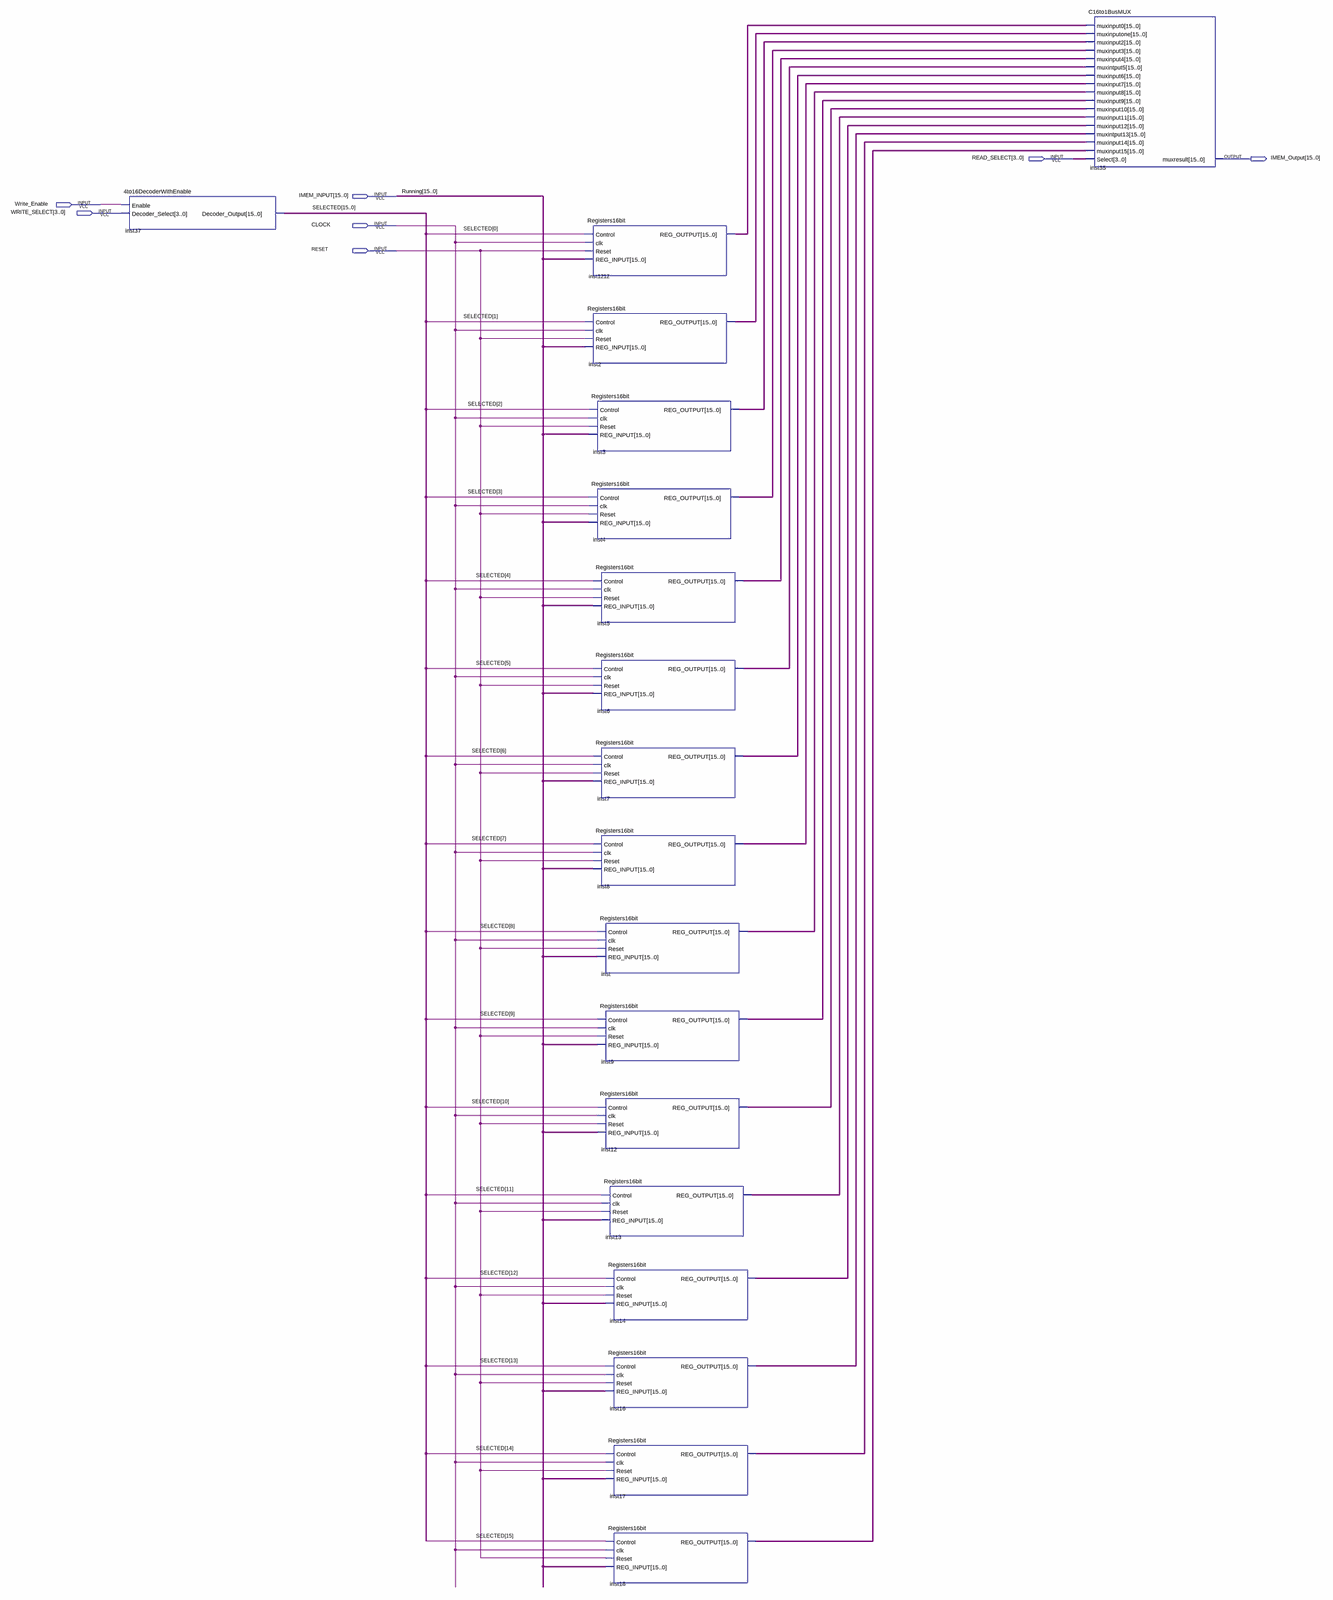
[diagram p0: schematic sheet, whole]
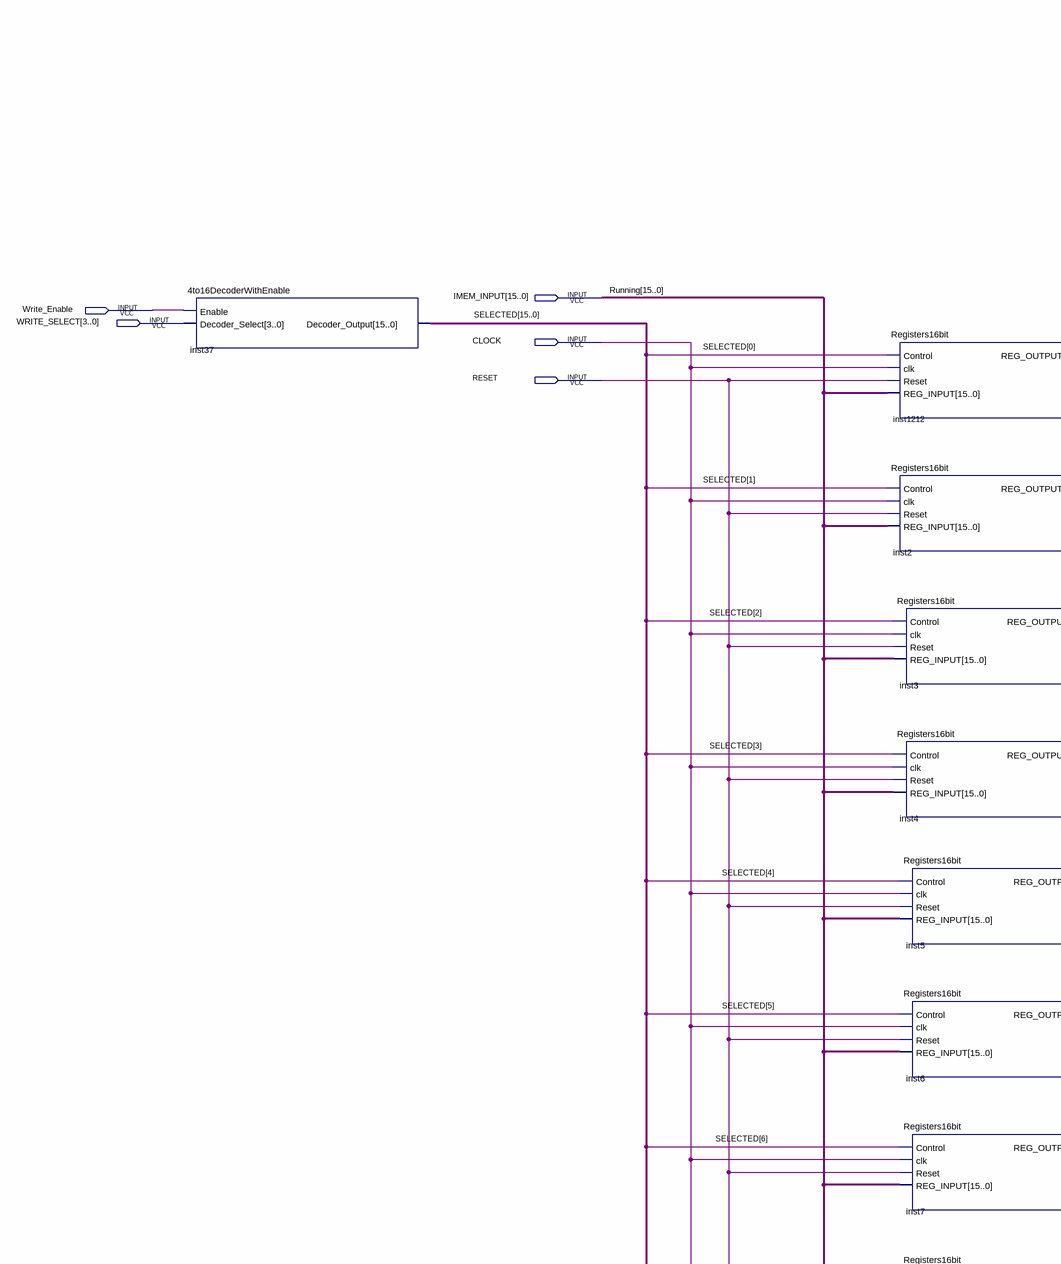
[diagram p1: schematic sheet, upper left part]
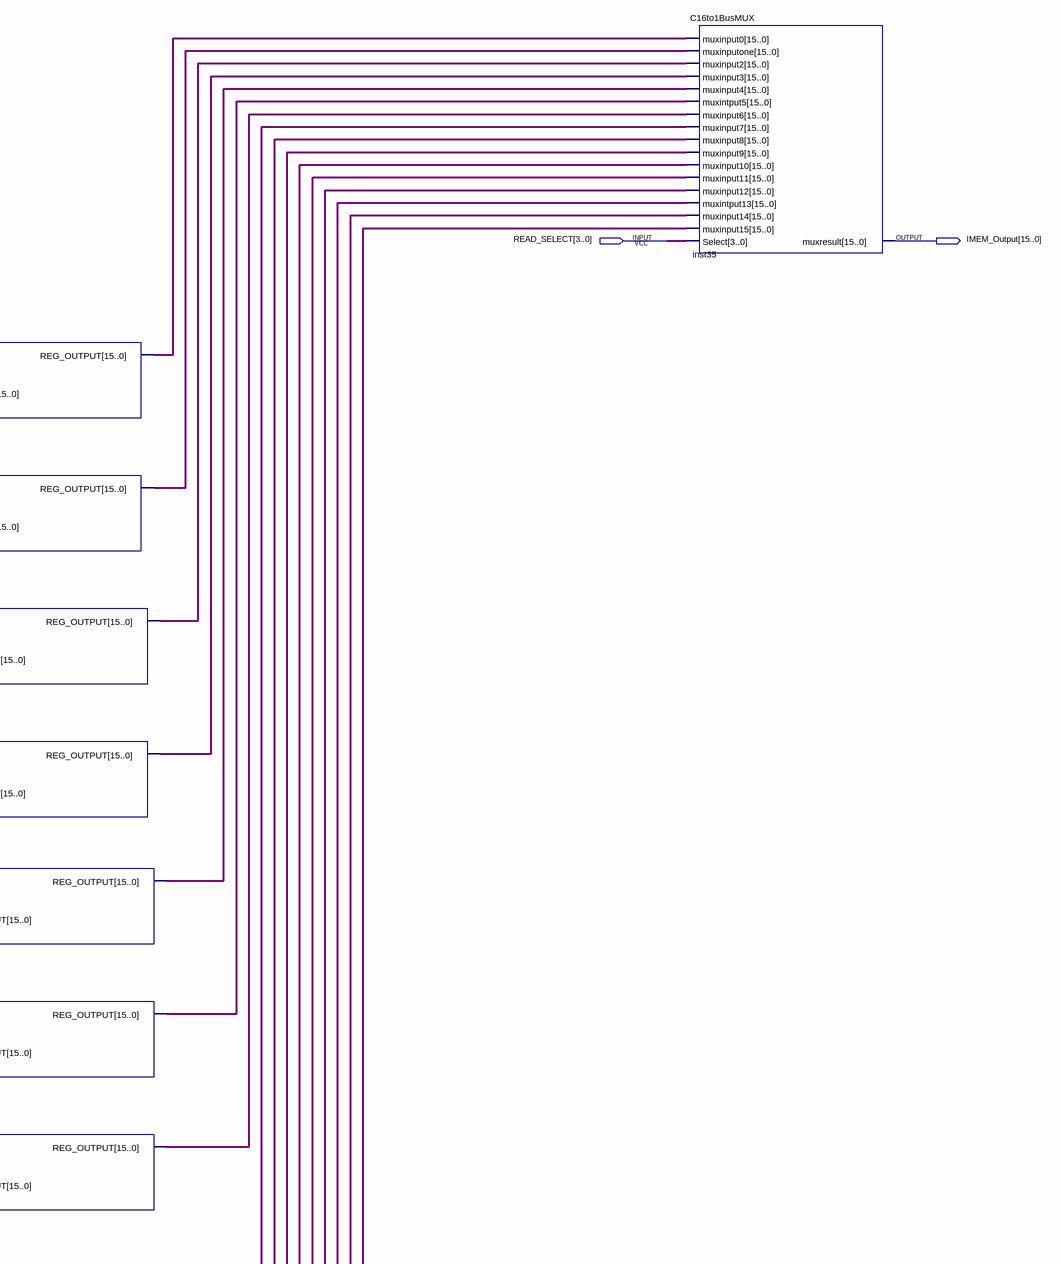
[diagram p2: schematic sheet, upper right part]
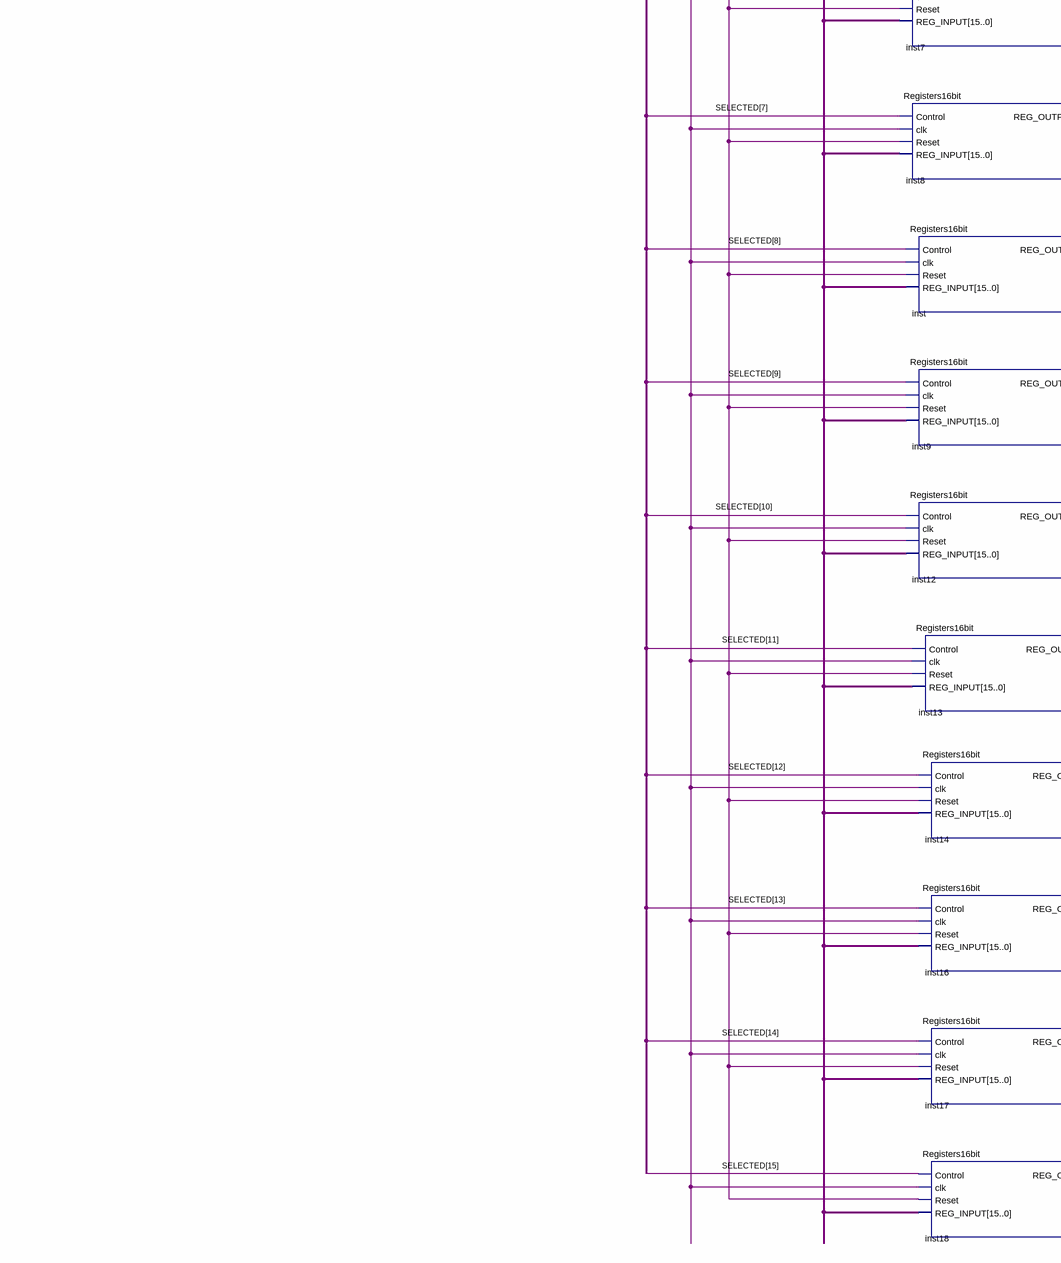
[diagram p3: schematic sheet, lower left part]
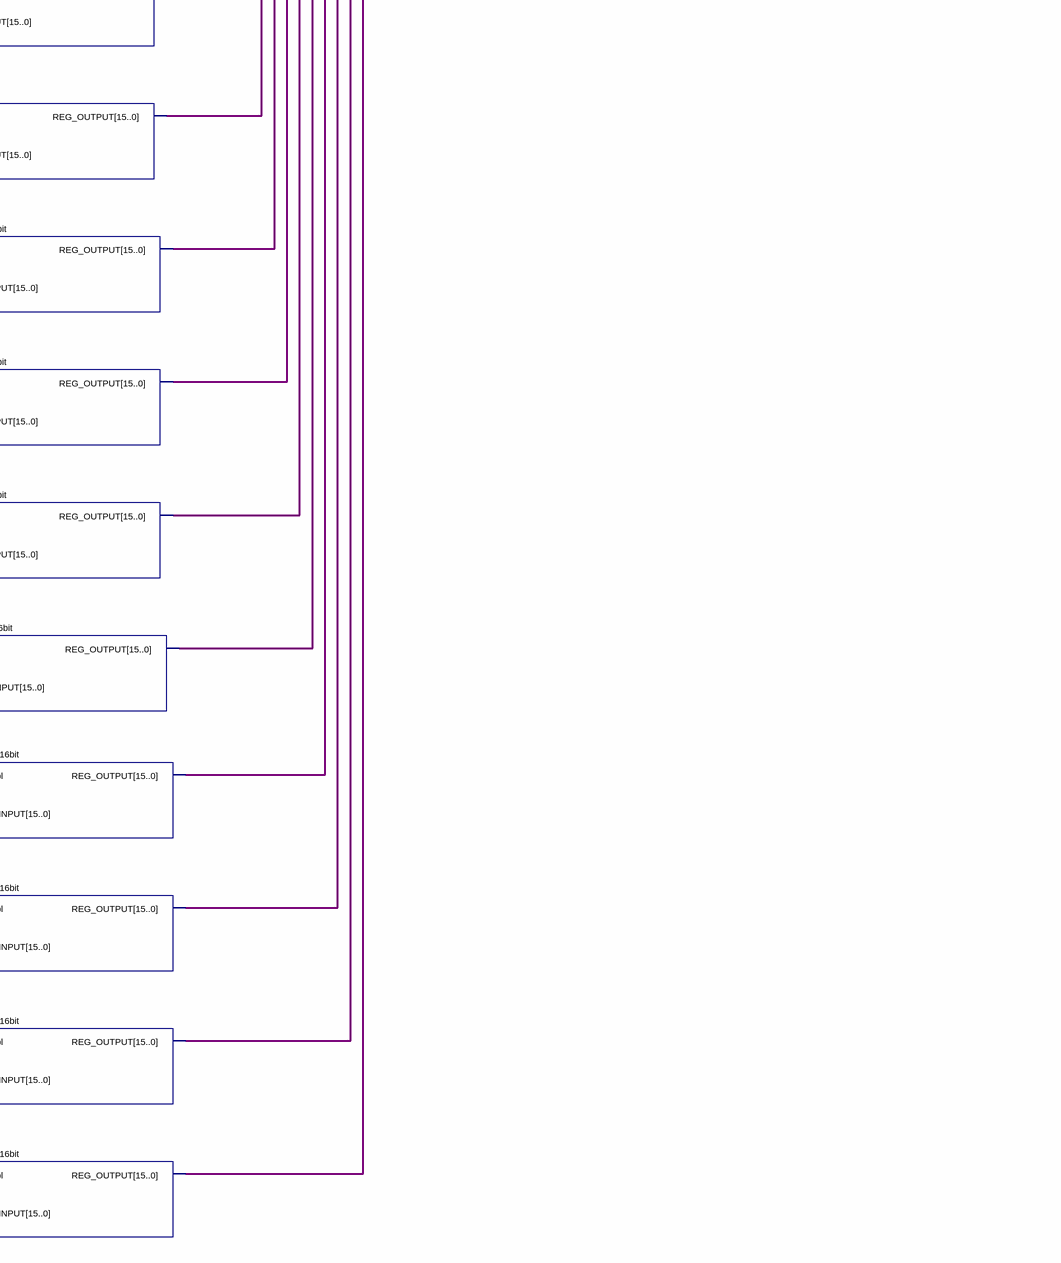
[diagram p4: schematic sheet, lower right part]
// Quartus schematic IMEM_no_preset.bdf as structural Verilog: 18 symbols, 7 pins
module IMEM_no_preset (
  input  [3:0] READ_SELECT,
  input  [15:0] IMEM_INPUT,
  input  Write_Enable,
  input  [3:0] WRITE_SELECT,
  input  CLOCK,
  input  RESET,
  output [15:0] IMEM_Output
);

  wire [15:0] inst2_reg_output, inst3_reg_output, inst4_reg_output, inst5_reg_output, inst6_reg_output,
       inst7_reg_output, inst8_reg_output, inst9_reg_output, inst12_reg_output, inst13_reg_output,
       inst14_reg_output, inst16_reg_output, inst17_reg_output, inst18_reg_output, inst1212_reg_output,
       inst_reg_output, SELECTED;

  \4to16DecoderWithEnable  inst37 (.Enable(Write_Enable), .Decoder_Select(WRITE_SELECT), .Decoder_Output(SELECTED));
  Registers16bit inst1212 (
    .Control(SELECTED[0]), .clk(CLOCK), .Reset(RESET), .REG_INPUT(IMEM_INPUT),
    .REG_OUTPUT(inst1212_reg_output));
  Registers16bit inst2 (
    .Control(SELECTED[1]), .clk(CLOCK), .Reset(RESET), .REG_INPUT(IMEM_INPUT), .REG_OUTPUT(inst2_reg_output));
  Registers16bit inst3 (
    .Control(SELECTED[2]), .clk(CLOCK), .Reset(RESET), .REG_INPUT(IMEM_INPUT), .REG_OUTPUT(inst3_reg_output));
  Registers16bit inst4 (
    .Control(SELECTED[3]), .clk(CLOCK), .Reset(RESET), .REG_INPUT(IMEM_INPUT), .REG_OUTPUT(inst4_reg_output));
  Registers16bit inst5 (
    .Control(SELECTED[4]), .clk(CLOCK), .Reset(RESET), .REG_INPUT(IMEM_INPUT), .REG_OUTPUT(inst5_reg_output));
  Registers16bit inst6 (
    .Control(SELECTED[5]), .clk(CLOCK), .Reset(RESET), .REG_INPUT(IMEM_INPUT), .REG_OUTPUT(inst6_reg_output));
  Registers16bit inst7 (
    .Control(SELECTED[6]), .clk(CLOCK), .Reset(RESET), .REG_INPUT(IMEM_INPUT), .REG_OUTPUT(inst7_reg_output));
  Registers16bit inst8 (
    .Control(SELECTED[7]), .clk(CLOCK), .Reset(RESET), .REG_INPUT(IMEM_INPUT), .REG_OUTPUT(inst8_reg_output));
  Registers16bit inst (
    .Control(SELECTED[8]), .clk(CLOCK), .Reset(RESET), .REG_INPUT(IMEM_INPUT), .REG_OUTPUT(inst_reg_output));
  Registers16bit inst9 (
    .Control(SELECTED[9]), .clk(CLOCK), .Reset(RESET), .REG_INPUT(IMEM_INPUT), .REG_OUTPUT(inst9_reg_output));
  Registers16bit inst12 (
    .Control(SELECTED[10]), .clk(CLOCK), .Reset(RESET), .REG_INPUT(IMEM_INPUT), .REG_OUTPUT(inst12_reg_output));
  Registers16bit inst13 (
    .Control(SELECTED[11]), .clk(CLOCK), .Reset(RESET), .REG_INPUT(IMEM_INPUT), .REG_OUTPUT(inst13_reg_output));
  Registers16bit inst14 (
    .Control(SELECTED[12]), .clk(CLOCK), .Reset(RESET), .REG_INPUT(IMEM_INPUT), .REG_OUTPUT(inst14_reg_output));
  Registers16bit inst16 (
    .Control(SELECTED[13]), .clk(CLOCK), .Reset(RESET), .REG_INPUT(IMEM_INPUT), .REG_OUTPUT(inst16_reg_output));
  Registers16bit inst17 (
    .Control(SELECTED[14]), .clk(CLOCK), .Reset(RESET), .REG_INPUT(IMEM_INPUT), .REG_OUTPUT(inst17_reg_output));
  Registers16bit inst18 (
    .Control(SELECTED[15]), .clk(CLOCK), .Reset(RESET), .REG_INPUT(IMEM_INPUT), .REG_OUTPUT(inst18_reg_output));
  C16to1BusMUX inst35 (
    .muxinput0(inst1212_reg_output), .muxinputone(inst2_reg_output), .muxinput2(inst3_reg_output),
    .muxinput3(inst4_reg_output), .muxinput4(inst5_reg_output), .muxintput5(inst6_reg_output),
    .muxinput6(inst7_reg_output), .muxinput7(inst8_reg_output), .muxinput8(inst_reg_output),
    .muxinput9(inst9_reg_output), .muxinput10(inst12_reg_output), .muxinput11(inst13_reg_output),
    .muxinput12(inst14_reg_output), .muxintput13(inst16_reg_output), .muxinput14(inst17_reg_output),
    .muxinput15(inst18_reg_output), .Select(READ_SELECT), .muxresult(IMEM_Output));

  // Other names for the same wires on the sheet: Running[15:0] = IMEM_INPUT
endmodule
